# EAGLE design FRAM with level converter (discrete) (EAGLE 6.5.0)
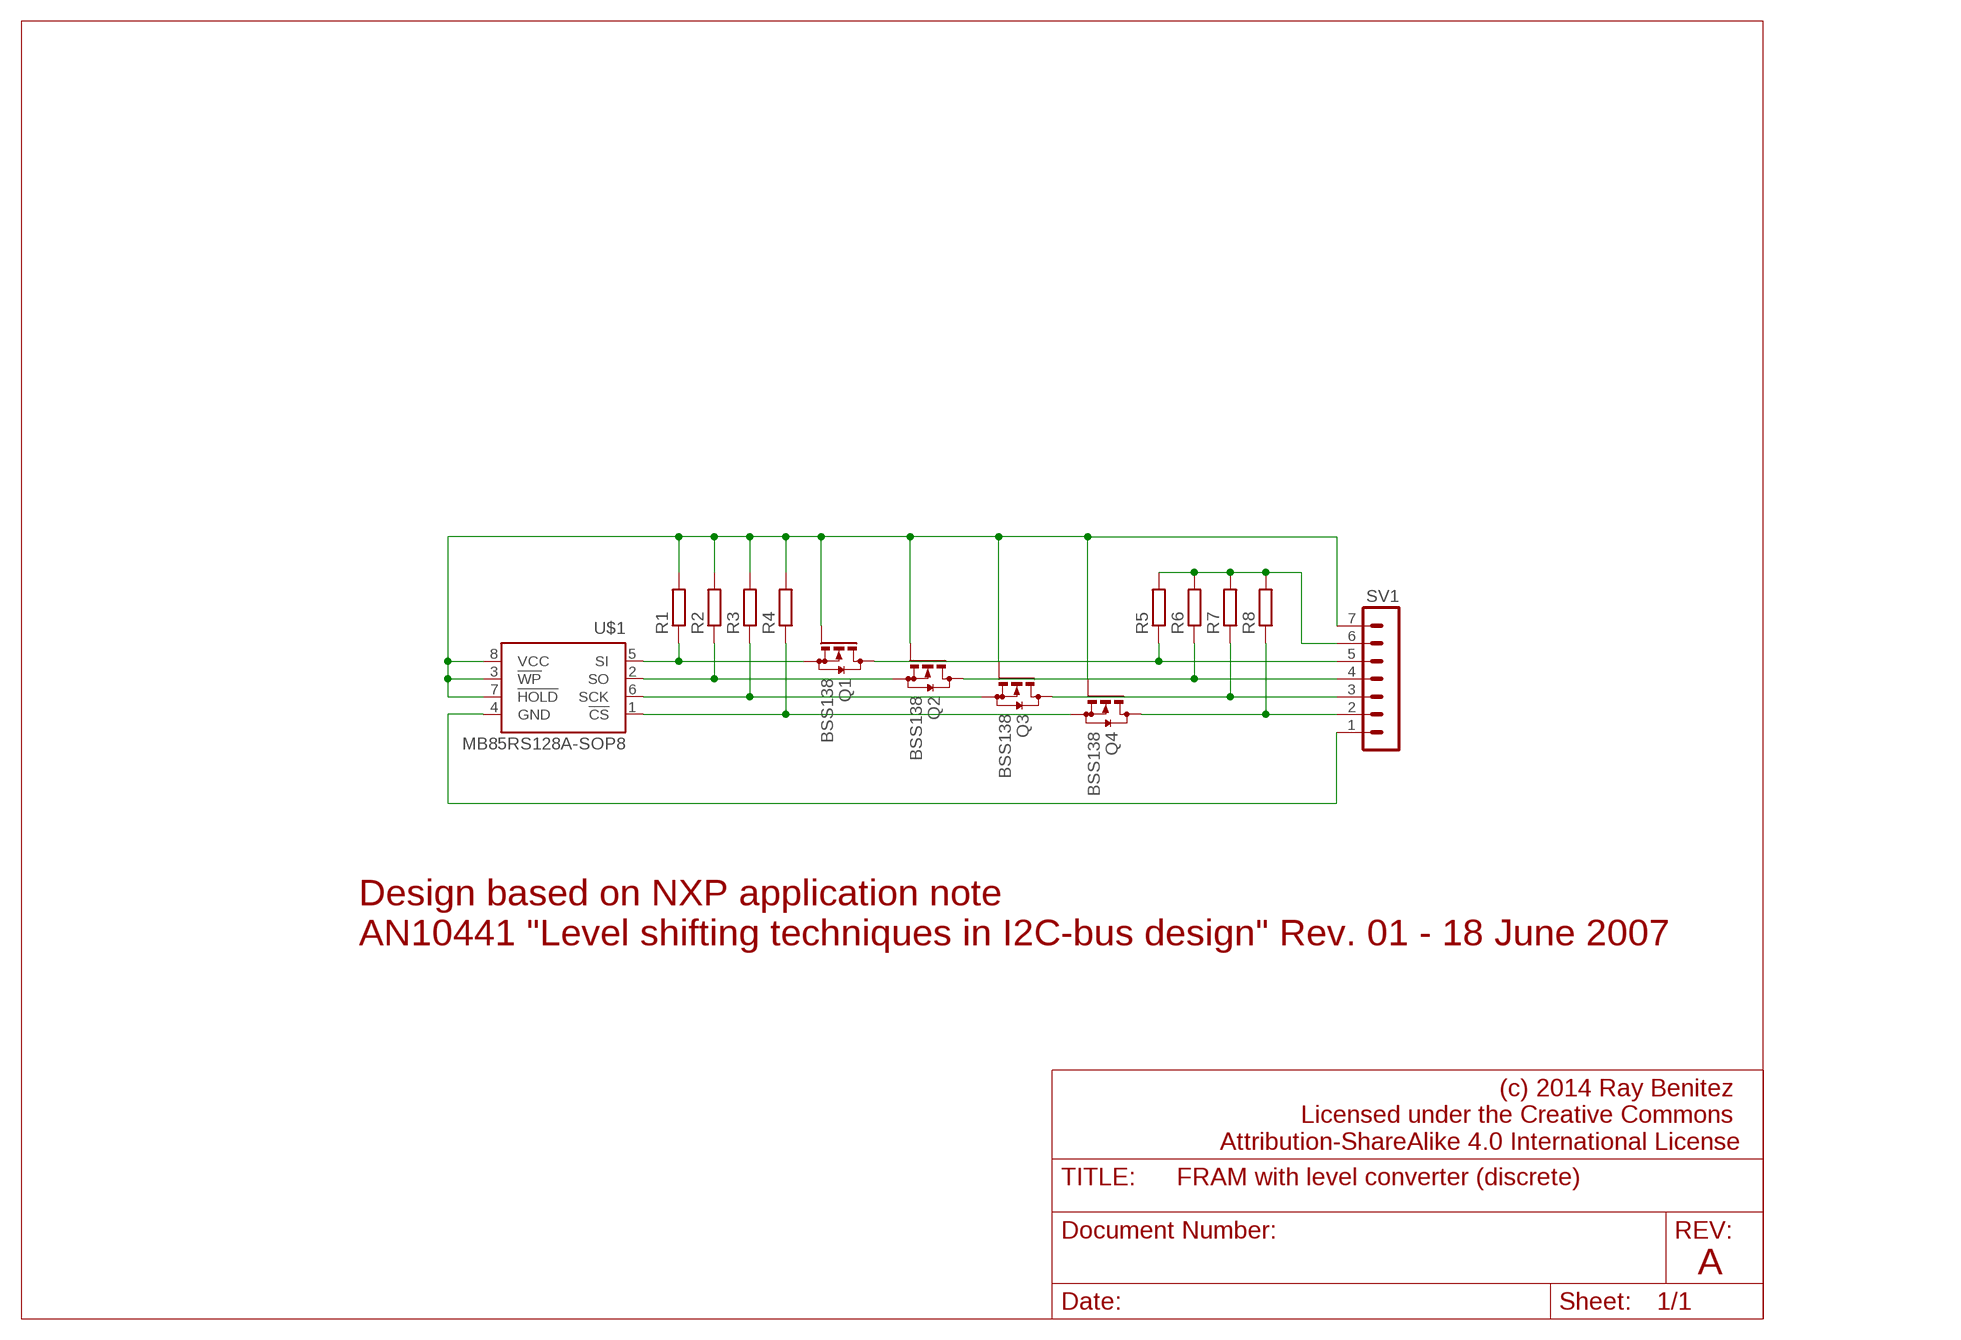
[diagram p0: schematic, sheet 1]

## Parts
Q1  BSS138  BSS138-SOT23  [SOT23]
Q2  BSS138  BSS138-SOT23  [SOT23]
Q3  BSS138  BSS138-SOT23  [SOT23]
Q4  BSS138  BSS138-SOT23  [SOT23]
R1  R-EU_R0805  [R0805]
R2  R-EU_R0805  [R0805]
R3  R-EU_R0805  [R0805]
R4  R-EU_R0805  [R0805]
R5  R-EU_R0805  [R0805]
R6  R-EU_R0805  [R0805]
R7  R-EU_R0805  [R0805]
R8  R-EU_R0805  [R0805]
SV1  MA07-1  [MA07-1]
U$1  MB85RS128A-SOP8  [SO08]

## Nets
GND: SV1.1 U$1.4(GND)
N$1: Q1.2(S) R1.1 U$1.5(SI)
N$2: Q2.2(S) R2.1 U$1.2(SO)
N$3: Q3.2(S) R3.1 U$1.6(SCK)
N$4: Q4.2(S) R4.1 U$1.1(!CS)
N$5: Q1.1(G) Q2.1(G) Q3.1(G) Q4.1(G) R1.2 R2.2 R3.2 R4.2 SV1.7 U$1.3(!WP) U$1.7(!HOLD) U$1.8(VCC)
N$6: Q4.3(D) R8.1 SV1.2
N$7: Q3.3(D) R7.1 SV1.3
N$8: Q2.3(D) R6.1 SV1.4
N$9: Q1.3(D) R5.1 SV1.5
N$10: R5.2 R6.2 R7.2 R8.2 SV1.6

## Notes on the sheet
- Design based on NXP application note
  AN10441 "Level shifting techniques in I2C-bus design" Rev. 01 - 18 June 2007
- (c) 2014 Ray Benitez 
  Licensed under the Creative Commons 
  Attribution-ShareAlike 4.0 International License
- A

## Library data of the parts
Q1-Q4 = hackscribble:BSS138: 50V N-CHANNEL ENHANCEMENT MODE VERTICAL DMOS FET IN SOT23
R1-R8 = resistor:R-EU_: RESISTOR, European symbol
SV1 = con-lstb:MA07-1: PIN HEADER; OC_FARNELL: unknown; OC_NEWARK: unknown
U$1 = hackscribble:MB85RS: Fujitsu MB85RS Ferroelectric RAM (FRAM) From http://www.fujitsu.com/global/services/microelectronics/product/memory/fram/standalone/

## Board
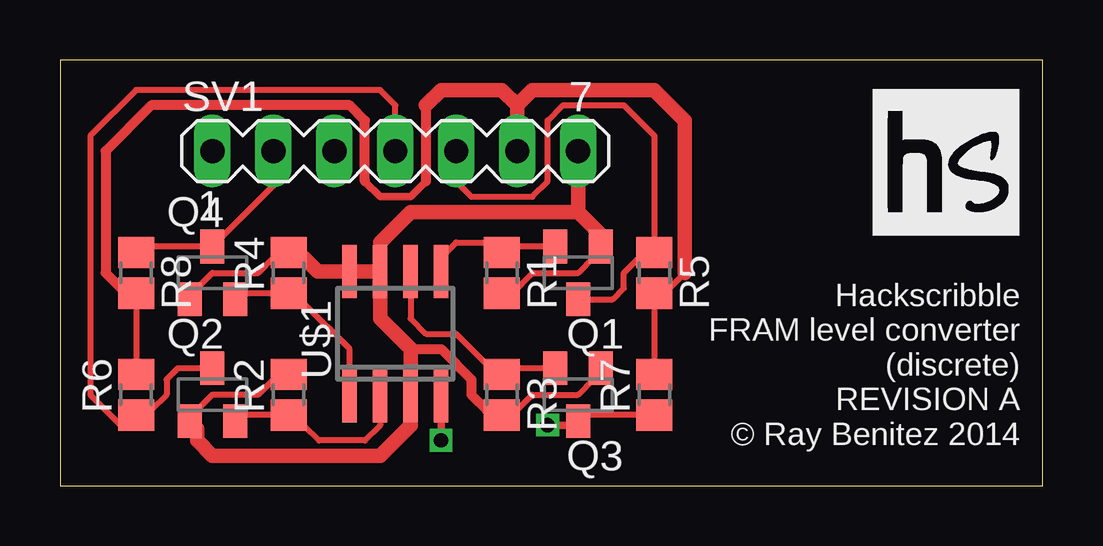
[diagram p1: board, top side]
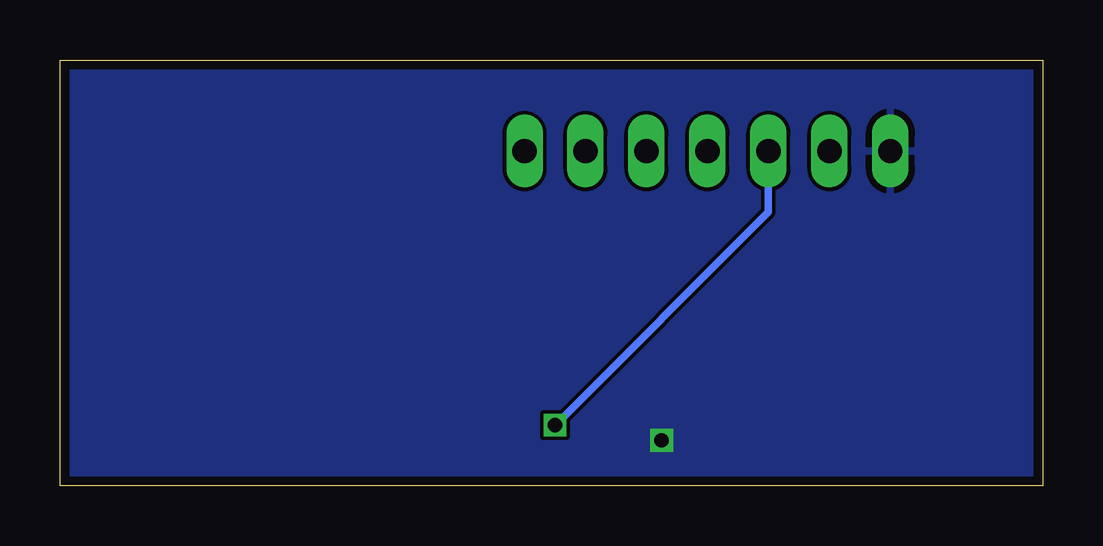
[diagram p2: board, bottom side, seen from below]

Size 40.95 x 17.77 mm. Coordinates in mm from the lower left corner, seen from the top.
Outline: 0,0 40.95,0 40.95,17.77 0,17.77 0,0
Copper layers (1*16): Top 0.0356mm / dielectric 1.5011mm / Bottom 0.0356mm
Design rules "LaenPCBOrder": minimum track width 6mil, minimum drill 13mil, track to track 6mil, track to pad 6mil, pad to pad 6mil, via to via 6mil, smd to smd 6mil, copper to edge 15mil, drill to drill 6mil, minimum pad ring 7mil, minimum via ring 7mil, stop-mask expansion 3mil, vias tented up to drill 0mil, thermal gap 10mil

### Footprints (pad centres in the part's own frame; a part is rotated, then mirrored left to right if it is on the bottom)
SOT23 = smd 1 x 1.4: 1 -0.95,-1.1; 2 0.95,-1.1; 3 0,1.1
R0805 = smd 1.3 x 1.5: 1 -0.85,0; 2 0.85,0
MA07-1 = drill 1.016 long: 1 -7.62,0; 2 -5.08,0; 3 -2.54,0; 4 0,0; 5 2.54,0; 6 5.08,0; 7 7.62,0
SO08 = smd 0.6 x 2.2: 1 -1.905,-2.6; 2 -0.635,-2.6; 3 0.635,-2.6; 4 1.905,-2.6; 5 1.905,2.6; 6 0.635,2.6; 7 -0.635,2.6; 8 -1.905,2.6

### Placement (x,y rotation side)
Q1  21.59,8.89 180 top
Q2  6.35,3.81 0 top
Q3  21.59,3.81 180 top
Q4  6.35,8.89 0 top
R1  18.41,8.89 270 top
R2  9.53,3.81 90 top
R3  18.41,3.81 270 top
R4  9.53,8.89 90 top
R5  24.77,8.89 270 top
R6  3.18,3.81 90 top
R7  24.77,3.81 90 top
R8  3.18,8.89 270 top
SV1  13.97,13.97 0 top
U$1  13.97,6.35 0 top

### Tracks (layer width: path | path; a pad name or v marks a point on that pad's centre or on a via)
GND  (via drill 0.6)
  Top 0.305: U$1.4 v15.88,1.9
  pour Bottom: 0,17.78 0,0 41.27,0 41.27,17.78
N$1
  Top 0.254: U$1.5 15.88,9.52 16.51,10.16 18.41,10.16 R1.1 18.66,9.99 Q1.2
N$2
  Top 0.254: Q2.2 7.55,2.96 R2.1 9.74,3.17 10.16,3.17 10.16,2.54 10.8,1.9 12.7,1.9 13.34,2.54 U$1.2
N$3
  Top 0.254: U$1.6 14.61,6.98 15.24,6.35 16.51,6.35 17.78,5.08 18,5.08 R3.1 18.66,4.91 Q3.2
N$4
  Top 0.254: Q4.2 7.55,8.04 R4.1 9.95,7.62 10.16,7.62 12.07,5.71 U$1.1
N$5
  Top 0.254: 10.16,9.52 9.74,9.52 R4.2 9.31,9.52 8.89,9.52 8.26,8.89 6.35,8.89 5.4,7.94 Q4.1 | Q3.1 22.23,4.59 22.23,4.45 21.59,3.81 19.69,3.81 18.84,2.96 R3.2 18.2,3.17 17.78,3.17 | 22.54,10.48 Q1.1 22.23,9.67 22.23,9.52 21.59,8.89 19.69,8.89 18.84,8.04 R1.2 | 13.34,10.16 U$1.7 | U$1.3 14.61,2.54 | 5.08,2.54 5.23,2.54 Q2.1 5.72,3.02 5.72,3.17 6.35,3.81 8.26,3.81 9.11,4.66 R2.2
  Top 0.406: 14.61,5.71 15.88,5.71 17.15,4.45 17.15,3.81 17.78,3.17
  Top 0.61: 10.16,9.52 10.73,8.95 U$1.8 U$1.7 13.34,6.98 14.61,5.71 U$1.3 | 22.54,10.48 21.59,11.43 | 21.59,11.43 14.61,11.43 13.34,10.16 | 14.61,2.54 13.34,1.27 6.35,1.27 5.72,1.9 5.72,2.39 Q2.1 | SV1.7 21.59,11.43
N$6
  Top 0.254: SV1.2 8.89,12.53 Q4.3 3.43,9.99 R8.1
N$7  (via drill 0.6)
  Top 0.254: R7.1 21.84,2.96 Q3.3
  Top 0.305: v20.32,2.54 21.42,2.54 Q3.3
  Bottom 0.305: SV1.3 11.43,11.43 v20.32,2.54
N$8
  Top 0.254: Q2.3 4.91,4.91 4.45,4.45 4.45,3.81 3.81,3.17 3.39,3.17 R6.1 2.76,2.54 2.54,2.54 1.27,3.81 1.27,14.6 3.18,16.51 13.34,16.51 13.97,15.88 SV1.4
N$9
  Top 0.254: Q1.3 23.03,7.79 23.5,8.25 23.5,8.89 24.13,9.52 24.55,9.52 R5.1 24.77,14.6 23.5,15.88 20.96,15.88 20.32,15.24 20.32,12.7 19.69,12.06 17.15,12.06 16.51,12.7 SV1.5
N$10
  Top 0.254: R6.2 R8.2 2.96,8.25 2.54,8.25 | R7.2 R5.2 24.98,8.25 25.4,8.25 26.04,8.89
  Top 0.305: 15.24,12.7 14.61,12.06 13.34,12.06 12.7,12.7
  Top 0.406: 15.24,15.88 15.24,12.7 | 2.54,8.25 1.91,8.89 1.91,13.97 3.81,15.88 12.07,15.88 12.7,15.24 12.7,12.7
  Top 0.61: 19.05,15.88 19.69,16.51 24.77,16.51 26.04,15.24 26.04,8.89 | SV1.6 19.05,15.88 | 19.05,15.88 18.41,16.51 15.88,16.51 15.24,15.88

### Text on the board
tNames: Hackscribble / FRAM level converter / (discrete) / REVISION A / © Ray Benitez 2014